# Altium project TSAL_Control.PrjPcb (part 3 of 4)

## Sheet [4] NoHV_RelaysClosed.SchDoc
size A4
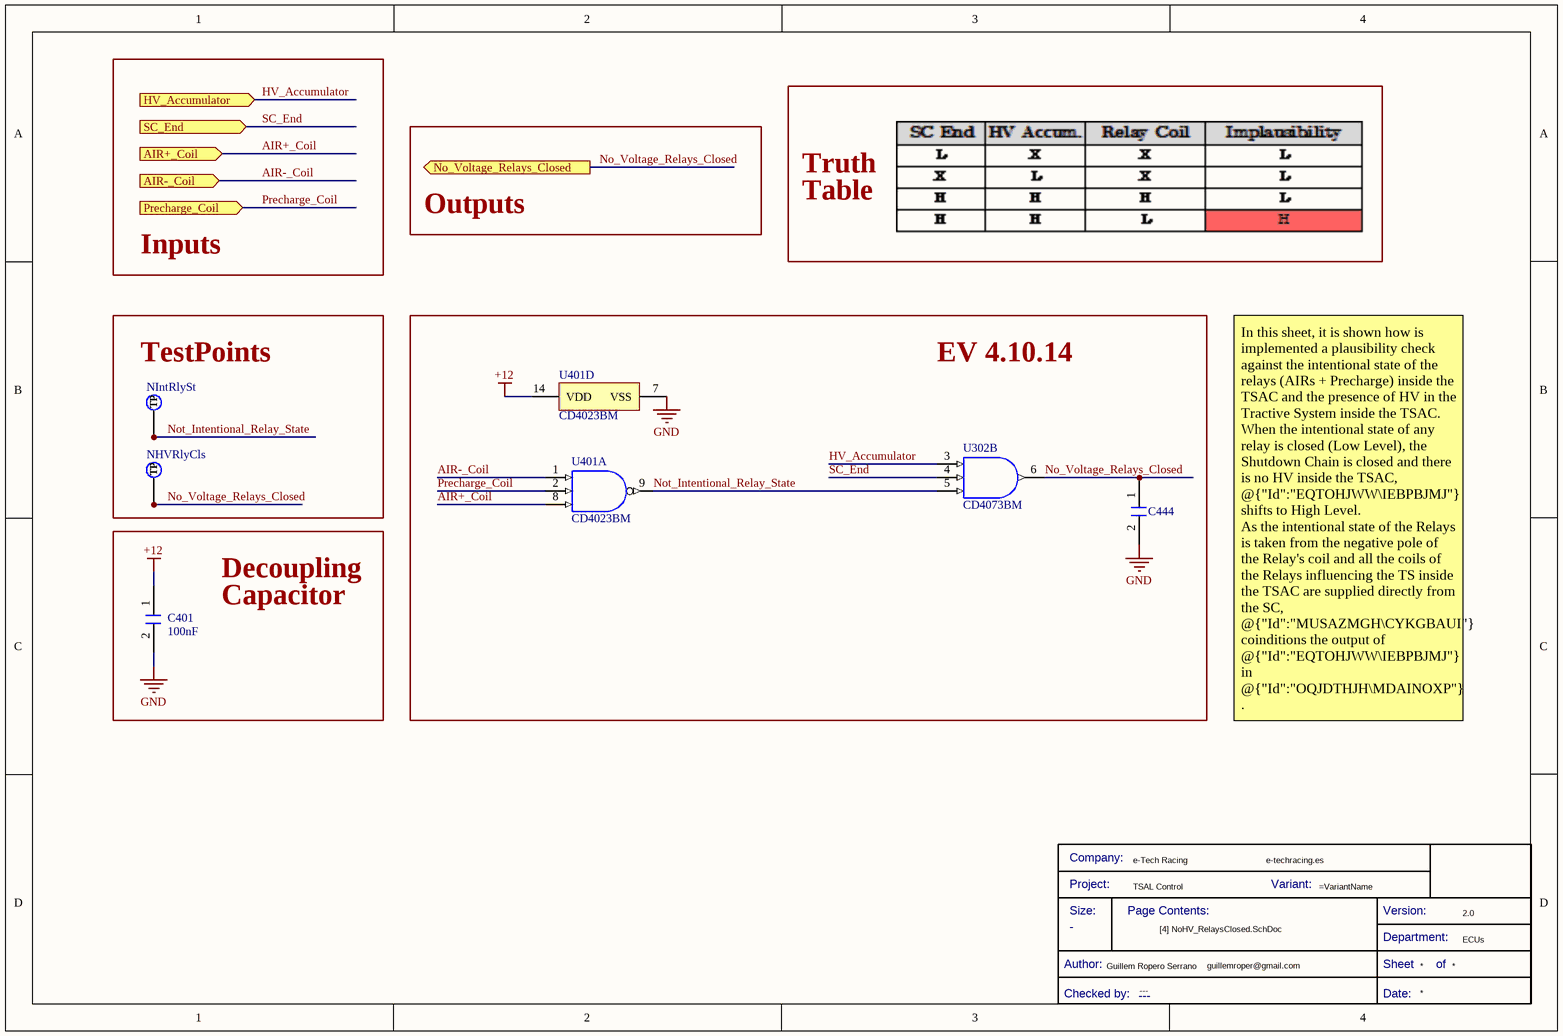
[diagram p5: [4] NoHV_RelaysClosed.SchDoc]

### Parts
(Parts that share a designator on the sheet are numbered #1, #2 ... from top to bottom, then left to right.)
*#6  Checked by:: ---  (hidden comment: Title Block_template)  (graphical)
C401  value 100nF  [C0805FNPC-R]  (hidden comment: C100n-50V-0805FNPC-X7R)
C444  C15p-50V-0805FNPC-NP0  [C0805FNPC-R]  (value not drawn)
NHVRlyCls  TestPoint  [TestPoint]  (value not drawn)  (no BOM)
NIntRlySt  TestPoint  [TestPoint]  (value not drawn)  (no BOM)
U302  CD4073BM  [D0014A_N]  (part B of 4)
U401  CD4023BM  [D0014A_N]  (parts A,D of 4)

### Blocks framed on the sheet
TestPoints: NHVRlyCls NIntRlySt
EV 4.10.14: C444 U302 U401

### Ports
AIR+_Coil (in, see [2] Implausibilities[3B], [1] TSAL_Green[2A], [2] Implausibilities[1A], [3] Relay Implausibility[1A]), AIR-_Coil (in, see [2] Implausibilities[3B], [1] TSAL_Green[2A], [2] Implausibilities[1A], [3] Relay Implausibility[1A]), HV_Accumulator (in, see [2] Implausibilities[3B], [1] TSAL_Green[2B], [2] Implausibilities[1A], [5] SCS[1A]), No_Voltage_Relays_Closed (out, see [2] Implausibilities[4B]), Precharge_Coil (in, see [2] Implausibilities[3B], [1] TSAL_Green[2B], [2] Implausibilities[1A], [3] Relay Implausibility[1A]), SC_End (in, see [2] Implausibilities[3B], [1] TSAL_Green[2B], [2] Implausibilities[1A], [3] Relay Implausibility[1B])

### Nets
+12: C401.1 U401.14(VDD)
GND: C401.2 C444.2 U401.7(VSS)
AIR+_Coil: U401.8(C) ; port AIR+_Coil
AIR-_Coil: U401.1(A) ; port AIR-_Coil
HV_Accumulator: U302.3(D) ; port HV_Accumulator
No_Voltage_Relays_Closed: C444.1 NHVRlyCls.1(TP) U302.6(K) ; port No_Voltage_Relays_Closed
Not_Intentional_Relay_State: NIntRlySt.1(TP) U302.5(F) U401.9(J)
Precharge_Coil: U401.2(B) ; port Precharge_Coil
SC_End: U302.4(E) ; port SC_End

### Notes on the sheet
- Truth
- Outputs
- Table
- Inputs
- Decoupling
- Capacitor
- In this sheet, it is shown how is implemented a plausibility check against the intentional state of the relays (AIRs + Precharge) inside the TSAC and the presence of HV in the Tractive System inside the TSAC.
  When the intentional state of any relay is closed (Low Level), the Shutdown Chain is closed and there is no HV inside the TSAC, @{"Id":"EQTOHJWW\IEBPBJMJ"} shifts to High Level.
  As the intentional state of the Relays is taken from the negative pole of the Relay's coil and all the coils of the Relays influencing the TS inside the TSAC are supplied directly from the SC, @{"Id":"MUSAZMGH\CYKGBAUI"} coinditions the output of @{"Id":"EQTOHJWW\IEBPBJMJ"} in @{"Id":"OQJDTHJH\MDAINOXP"} .
- (in symbol CMP-00043-8) Company:; Project:; Variant:; Size:; Page Contents:; Version:; Department:; Author:; Sheet; of; Checked by:; Date:

### Library data of the parts
*#6 = CMP-00043-8: Standard Title Block; .SCHcheck: GP; Size: -; Design Item ID: Title Block_template; .PCBcheck: GP; .Creator: GP; Source: e-Tech_Racing.SchLib; Category: Title Block
C401 = CMP-00063-3: Cap, 0.1ΜF, 50V, 10%, X7R, 0805; Manufacturer Part Number 1: 885012207098; Manufacturer 1: Wurth Electronics; .Creator: DR; ComponentLink2Description: http://www.farnell.com/datasheets/1958498.pdf?src-supplier=Element14; ComponentLink1Description: http://www.farnell.com/datasheets/1958498.pdf?src-supplier=Farnell; Thickness: 0.035inch; ComponentLink1URL: http://www.farnell.com/datasheets/1958498.pdf?src-supplier=Farnell; Min Operating Temperature: -55°C; Packaging: Cut Tape; ComponentLink2URL: http://www.farnell.com/datasheets/1958498.pdf?src-supplier=Element14; Mount: Surface Mount; Voltage Rating (DC): 50V; Tolerance: 10%; Category: Ceramic Capacitors; RoHS: Yes; Width: 0.049inch; Pricing 1: 100=0,10200, 500=0,07100, 2000=0,06100 (GBP); RoHS Compliant: Yes; ComponentLink4Description: http://www.farnell.com/datasheets/1958498.pdf?src-supplier=Newark; Dielectric: X7R; Stock 1: 8000; Length: 0.079inch; ComponentLink3URL: https://katalog.we-online.de/pbs/datasheet/885012207098.pdf?src-supplier=Digi-Key; ComponentLink3Description: https://katalog.we-online.de/pbs/datasheet/885012207098.pdf?src-supplier=Digi-Key; Design Item ID: C100n-50V-0805FNPC-X7R; ComponentLink4URL: http://www.farnell.com/datasheets/1958498.pdf?src-supplier=Newark; REACH SVHC: Unknown; Case Code (Metric): 2012; Voltage Rating: 50V; Max Operating Temperature: 125°C; Source: Passives.SchLib; Case/Package: 0805
C444 = CMP-00056-3: Cap, 15PF, 50V, 5%, C0G/NP0, 0805; Manufacturer Part Number 1: 885012007052; Manufacturer 1: Wurth Electronics; .Creator: DR; Thickness: 0.028inch; RoHS Compliant: Yes; ComponentLink2URL: http://katalog.we-online.de/pbs/datasheet/885012007052.pdf?src-supplier=Digi-Key; Design Item ID: C15p-50V-0805FNPC-NP0; Case Code (Metric): 2012; Max Operating Temperature: 125°C; Mount: Surface Mount; Category: Ceramic Capacitors; Min Operating Temperature: -55°C; Case/Package: 0805; ComponentLink3Description: https://katalog.we-online.de/pbs/datasheet/885012007052.pdf?src-supplier=Digi-Key; ComponentLink1Description: http://www.farnell.com/datasheets/2031702.pdf?src-supplier=Farnell; ComponentLink1URL: http://www.farnell.com/datasheets/2031702.pdf?src-supplier=Farnell; RoHS: Yes; Voltage Rating: 50V; Length: 0.079inch; Source: Passives.SchLib; Value: 15pF; Pricing 1: 1=0,10800, 10=0,05200, 25=0,05100, 50=0,04900, 100=0,04800, 250=0,04600, 500=0,04300 (USD); Tolerance: 5%; ComponentLink3URL: https://katalog.we-online.de/pbs/datasheet/885012007052.pdf?src-supplier=Digi-Key; Stock 1: 815; Packaging: Cut Tape; Width: 0.049inch; ComponentLink2Description: http://katalog.we-online.de/pbs/datasheet/885012007052.pdf?src-supplier=Digi-Key
NHVRlyCls NIntRlySt = CMP-00042-2: Test Point 1x1 mm; .SCHcheck: GP; Category: TestPoint; Source: e-Tech_Racing.SchLib; .Creator: GP; .PCBcheck: GP; Design Item ID: TestPoint
U302 = CMP-00213-1: AND Gate, 4000/14000/40000 Series, 3-Func, 3-Input, CMOS, PDSO14; Propagation Delay (tpd): 250ns; Nominal Supply Voltage: 5V; Power Supplies: 5/15V; Qualification Status: Not Qualified; Package Equivalence Code: SOP14,.25; Channels: 3; Min Supply Voltage: 3V; Package Body Material: Plastic; Max Supply Voltage: 18V; Load Capacitance (CL): 50pF; Load/Preset Input: Yes; Schmitt Trigger: No; Terminal Pitch: 1.27mm; Terminal Form: Gull Wing; Length: 8.65mm; Logic Type: AND GATE; Prop. Delay@Nom-Sup: 250ns; Package Style: SMALL OUTLINEMeter; JESD-609 Code: e4; Package Shape: Rectangular; Moisture Sensitivity Level: 1; Max Operating Temperature: 125°C; Min Operating Temperature: -55°C; Case/Package: SOP; Terminal Finish: Nickel; Width: 3.9mm; Surface Mount: Yes; Reach SVHC Compliant: Yes; Technology: CMOS; Terminal Position: DUAL; Height - Seated (Max): 1.75mm; Temperature Grade: MILITARY; Number of Inputs: 3; Packaging: Rail/Tube; Pins: 14; Peak Reflow Temperature (Cel): 260°C; JESD-30 Code: R-PDSO-G14; RoHS Compliant: Yes
U401 = CMP-00215-1: NAND Gate, 4000/14000/40000 Series, 3-Func, 3-Input, CMOS, CDIP14; Min Supply Voltage: 5V; Package Body Material: Metal; Surface Mount: No; Number of Inputs: 3; Max Supply Voltage: 15V; Qualification Status: Not Qualified; Nominal Supply Voltage: 10V; Propagation Delay (tpd): 250ns; Pins: 14; Case/Package: DIP; Terminal Pitch: 2.54mm; Terminal Form: Through Hole; Height - Seated (Max): 5.08mm; Max Operating Temperature: 125°C; Min Operating Temperature: -55°C; Package Shape: Rectangular; Width: 7.62mm; Logic Type: NAND GATE; Technology: CMOS; Channels: 3; Temperature Grade: MILITARY; Terminal Position: DUAL; Package Style: IN-LINEMeter

## Sheet [6] Green_Driver.SchDoc
size A4
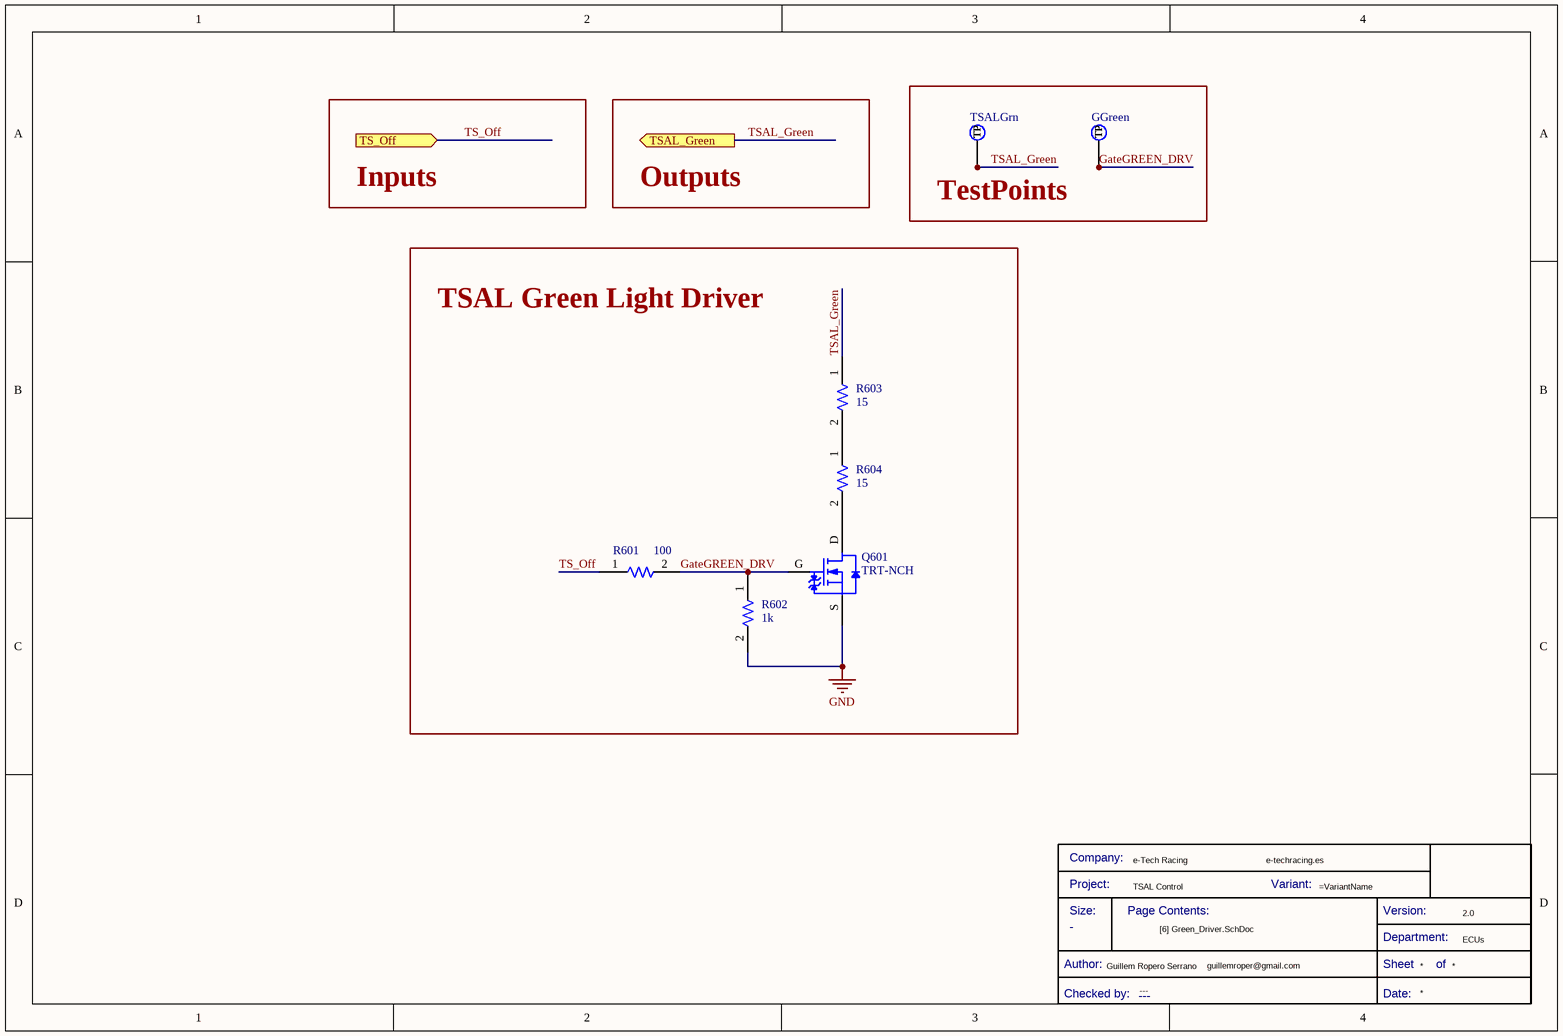
[diagram p6: [6] Green_Driver.SchDoc]

### Parts
(Parts that share a designator on the sheet are numbered #1, #2 ... from top to bottom, then left to right.)
*#7  Checked by:: ---  (hidden comment: Title Block_template)  (graphical)
GGreen  TestPoint  [TestPoint]  (value not drawn)  (no BOM)
Q601  TRT-NCH  [TRT-NCH-D2PAK]
R601  value 100  [R0805FTK]  (hidden comment: R100-0805FTK)
R602  value 1k  [R0805FTK]  (hidden comment: R1k-0805FTK)
R603  value 15  [R_3521]  (hidden comment: R15_3521_2W)
R604  value 15  [R_3521]  (hidden comment: R15_3521_2W)
TSALGrn  TestPoint  [TestPoint]  (value not drawn)  (no BOM)

### Blocks framed on the sheet
TestPoints: GGreen TSALGrn
TSAL Green Light Driver: Q601 R601-R604

### Ports
TS_Off (in, see [1] TSAL_Green[1D], [1] TSAL_Green[4A], [2] Implausibilities[1A], [5] SCS[1A]), TSAL_Green (out, see [1] TSAL_Green[2D], [1] TSAL_Green[4A], [2] Implausibilities[1A], [5] SCS[1A])

### Nets
GND: Q601.S R602.2
GateGREEN_DRV: GGreen.1(TP) Q601.G R601.2 R602.1
TS_Off: R601.1 ; port TS_Off
TSAL_Green: R603.1 TSALGrn.1(TP) ; port TSAL_Green
NetQ601_D: Q601.D R604.2
NetR603_2: R603.2 R604.1

### Notes on the sheet
- Inputs
- Outputs
- (in symbol CMP-00043-8) Company:; Project:; Variant:; Size:; Page Contents:; Version:; Department:; Author:; Sheet; of; Checked by:; Date:

### Library data of the parts
*#7 = CMP-00043-8: Standard Title Block; .SCHcheck: GP; Size: -; Design Item ID: Title Block_template; .PCBcheck: GP; .Creator: GP; Source: e-Tech_Racing.SchLib; Category: Title Block
GGreen TSALGrn = CMP-00042-2: Test Point 1x1 mm; .SCHcheck: GP; Category: TestPoint; Source: e-Tech_Racing.SchLib; .Creator: GP; .PCBcheck: GP; Design Item ID: TestPoint
Q601 = CMP-00139-1: MOSFET N-CH 100V 31A DPAK; Manufacturer 1: Infineon; Manufacturer Part Number 1: IRFR3410TRPBF; Rds On Max: 39mR; Turn-On Delay Time: 12ns; Polarization: N; Threshold Voltage: 4V; Power Dissipation: 110W; Input Capacitance: 1.69nF; Max Power Dissipation: 3W; Gate to Source Voltage (Vgs): 20V; Turn-Off Delay Time: 40ns; RoHS Compliant: Yes; Number of Pins: 3; Design Item ID: TRT-NCH-31/100; Packaging: Cut Tape; Min Operating Temperature: -55°C; Length: 0.264inch; Max Dual Supply Voltage: 100V; Halogen Free: Halogen Free; Drain to Source Resistance: 39mR; Case/Package: TO-252-3; Mount: Surface Mount; Series: HEXFET®; Source: Semiconductor.SchLib; Stock 1: 4070; Height: 0.094inch; Width: 0.245inch; RoHS: Yes; ComponentLink1URL: https://www.mouser.es/datasheet/2/427/sq2318bes-1868475.pdf; Pricing 1: 1=1,20000, 10=1,08000, 100=0,84200, 500=0,69600 (EUR); ComponentLink1Description: Datasheet; Lead Free: Contains Lead; Drain to Source Breakdown Voltage: 100V; Max Operating Temperature: 175°C; Drain to Source Voltage (Vdss): 100V; Category: MOSFETs; Continuous Drain Current (ID): 31A; Reach SVHC Compliant: Yes
R601 = CMP-00083-3: Res Thick Film 0805 100 Ohm 1% 1/8W ±100ppm/°C Molded SMD SMD Paper Tape on Plastic Reel; Manufacturer Part Number 1: CR0805-FX-1000ELF; Manufacturer 1: Bourns; Power Rating: 125mW; Voltage Rating (DC): 150V; .Creator: DR; Military Standard: Not; Radiation Hardening: No; Max Operating Temperature: 155°C; Packaging: Tape and Reel; ComponentLink3Description: https://datasheet.ciiva.com/6547/chpreztr-6547414.pdf?src-supplier=Digi-Key; RoHS Compliant: Yes; ComponentLink5Description: https://datasheet.ciiva.com/9120/chpreztr-9120744.pdf?src-supplier=Avnet; ComponentLink4URL: https://datasheet.ciiva.com/6547/chpreztr-6547415.pdf?src-supplier=Digi-Key; REACH SVHC: No SVHC; Depth: 1.25mm; Case/Package: 0805; Series: CR0805; Pricing 1: 1=0,05840, 10=0,03430, 25=0,01780, 100=0,00750, 250=0,00560, 500=0,00490, 3000=0,00470 (USD); Features: Moisture Resistant; Design Item ID: R100-0805FTK; Resistor Type: Thick Film; ComponentLink3URL: https://datasheet.ciiva.com/6547/chpreztr-6547414.pdf?src-supplier=Digi-Key; Construction: Rectangular; Width: 1.25mm; ComponentLink4Description: https://datasheet.ciiva.com/6547/chpreztr-6547415.pdf?src-supplier=Digi-Key; Stock 1: 49802; ComponentLink1URL: https://datasheet.ciiva.com/11809/0900766b80fcdb72-11809178.pdf?src-supplier=RSComponents; Number of Terminations: 2; ComponentLink1Description: https://datasheet.ciiva.com/11809/0900766b80fcdb72-11809178.pdf?src-supplier=RSComponents; Length: 2mm; Min Operating Temperature: -55°C; Height: 0.5mm; Mount: Surface Mount; Max Power Dissipation: 125mW; Technology: THICK FILM; Case Code (Metric): 2012; Tolerance: 1%; Category: Chip SMD Resistors; Thickness: 508um; Source: Passives.SchLib; Resistance Tolerance: 1%; RoHS: Yes; ComponentLink5URL: https://datasheet.ciiva.com/9120/chpreztr-9120744.pdf?src-supplier=Avnet; Temperature Coefficient: 100ppm/°C; Package Quantity: 1; Pins: 2; Contact Plating: Tin; Voltage Rating: 150V; Termination: SMD/SMT; ComponentLink2Description: https://datasheet.ciiva.com/6547/chpreztr-6547413.pdf?src-supplier=Digi-Key; ComponentLink2URL: https://datasheet.ciiva.com/6547/chpreztr-6547413.pdf?src-supplier=Digi-Key
R602 = CMP-00076-3: Res Thick Film 0805 1K Ohm 5% 1/8W ±200ppm/°C Molded SMD SMD Paper Tape on Plastic Reel; Manufacturer Part Number 1: CR0805-JW-102ELF; Manufacturer 1: Bourns; Voltage Rating (DC): 150V; Power Rating: 125mW; .Creator: GP; Number of Terminations: 2; REACH SVHC: No SVHC; ComponentLink3URL: https://datasheet.ciiva.com/22693/1902866-22693253.pdf?src-supplier=Element14; ComponentLink1URL: https://datasheet.ciiva.com/11821/0900766b80fcdb72-11821134.pdf?src-supplier=RSComponents; ComponentLink1Description: https://datasheet.ciiva.com/11821/0900766b80fcdb72-11821134.pdf?src-supplier=RSComponents; Category: Chip SMD Resistors; Stock 1: 27510; Case/Package: 0805; ComponentLink3Description: https://datasheet.ciiva.com/22693/1902866-22693253.pdf?src-supplier=Element14; Length: 2mm; ComponentLink5URL: https://datasheet.ciiva.com/7985/1856384-7985867.pdf?src-supplier=Element14; ComponentLink7Description: https://datasheet.ciiva.com/6547/chpreztr-6547359.pdf?src-supplier=Digi-Key; Package Quantity: 1; Tolerance: 5%; Lead Free: Lead Free; RoHS: Yes; Contact Plating: Tin; ComponentLink2Description: https://datasheet.ciiva.com/15225/getdatasheetpartid-78155-15225381.pdf?src-supplier=Verical; ComponentLink5Description: https://datasheet.ciiva.com/7985/1856384-7985867.pdf?src-supplier=Element14; Depth: 1.25mm; Thickness: 508um; Resistor Type: Thick Film; Design Item ID: R1k-0805FTK; ComponentLink2URL: https://datasheet.ciiva.com/15225/getdatasheetpartid-78155-15225381.pdf?src-supplier=Verical; Max Operating Temperature: 155°C; ComponentLink6URL: https://datasheet.ciiva.com/30242/159chpreztr-30242765.pdf?src-supplier=Onlinecomponents.com; ComponentLink4URL: https://datasheet.ciiva.com/7986/1856384-7986184.pdf?src-supplier=Element14; Military Standard: Not; Case Code (Metric): 2012; Temperature Coefficient: 200ppm/°C; Pricing 1: 1=0,05930, 10=0,03510, 25=0,01790, 100=0,00800, 250=0,00790, 500=0,00590, 1000=0,00360, 3000=0,00350, 6000=0,00250 (USD); Min Operating Temperature: -55°C; ComponentLink7URL: https://datasheet.ciiva.com/6547/chpreztr-6547359.pdf?src-supplier=Digi-Key; Width: 1.25mm; Source: Passives.SchLib; Max Power Dissipation: 125mW; Voltage Rating: 150V; ComponentLink4Description: https://datasheet.ciiva.com/7986/1856384-7986184.pdf?src-supplier=Element14; Features: Moisture Resistant; Mount: Surface Mount; Termination: SMD/SMT; Height: 0.5mm; Radiation Hardening: No; ComponentLink6Description: https://datasheet.ciiva.com/30242/159chpreztr-30242765.pdf?src-supplier=Onlinecomponents.com; Pins: 2; Packaging: Tape and Reel
R603 R604 = CMP-00075-7: Res Thick Film 2512 15 Ohm 1% 2W ±100ppm/C Pad SMD T/R; Manufacturer Part Number 1: 352115RFT; Manufacturer 1: TE Connectivity; .Creator: DR; Voltage Rating: 250V; Temperature Coefficient: 100ppm/°C; Number of Resistors: 1; Features: Automotive AEC-Q200; RoHS: Yes; ComponentLink2Description: Where buy it; Pricing 1: 10=0,64300, 250=0,62200, 1000=0,60000, 2000=0,55400, 2500=0,52100 (USD); ComponentLink1Description: Datasheet; Technology: THICK FILM; Stock 1: 1; Termination: Solder; ComponentLink2URL: https://es.rs-online.com/web/p/resistencias-de-montaje-en-superficie/7551110; Mount: Surface Mount; Resistance Tolerance: 1%; ComponentLink4Description: https://datasheet.ciiva.com/46391/1610601-46391493.pdf?src-supplier=Element14; Category: Chip SMD Resistors; Series: 3521, CGS; Depth: 3.2mm; ELV: Compliant; Tolerance: 1%; ComponentLink5Description: https://datasheet.ciiva.com/7657/1610601-7657542.pdf?src-supplier=Element14; Case Code (Metric): 6432; Design Item ID: R15-2512FTK; ComponentLink1URL: https://docs.rs-online.com/8bc1/0900766b81096b90.pdf; Max Operating Temperature: 155°C; ComponentLink4URL: https://datasheet.ciiva.com/46391/1610601-46391493.pdf?src-supplier=Element14; RoHS Compliant: Yes; Number of Terminations: 2; Source: Passives.SchLib; Resistor Type: Thick Film,Power resistor; Height: 0.55mm; Case/Package: 2512; ComponentLink3URL: https://datasheet.ciiva.com/25610/0900766b81096b90-25610033.pdf?src-supplier=RSComponents; Max Power Dissipation: 2W; Length: 6.3mm; Packaging: Tape and Reel; ComponentLink3Description: https://datasheet.ciiva.com/25610/0900766b81096b90-25610033.pdf?src-supplier=RSComponents; Voltage Rating (DC): 250V; Min Operating Temperature: -55°C; REACH SVHC: No SVHC; ComponentLink5URL: https://datasheet.ciiva.com/7657/1610601-7657542.pdf?src-supplier=Element14

## Sheet [7] TSAL_Red.SchDoc
size A4
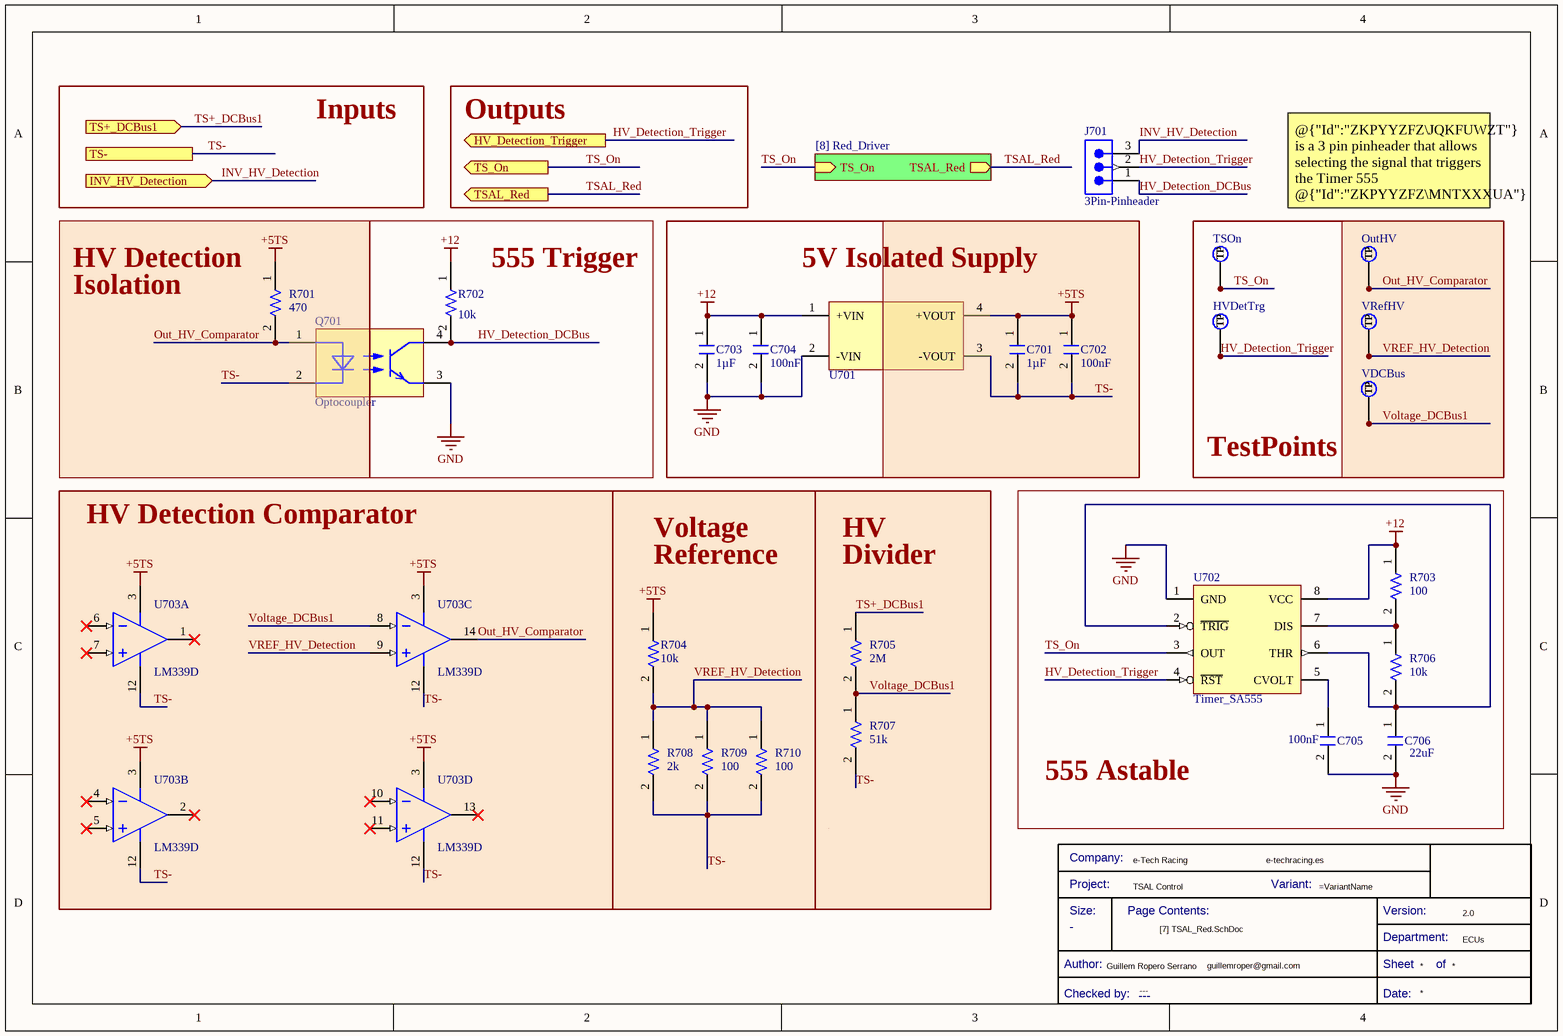
[diagram p7: [7] TSAL_Red.SchDoc]

### Parts
(Parts that share a designator on the sheet are numbered #1, #2 ... from top to bottom, then left to right.)
*#8  Checked by:: ---  (hidden comment: Title Block_template)  (graphical)
C701  value 1µF  [C0805FNPC-R]  (hidden comment: C1u-50V-0805FNPC-X7R)
C702  Capacitance: 100nF  [WCAP-CSGP_0805_L2W1.25H0.8_Reflow]  (hidden comment: C100n-16V-0805)
C703  value 1µF  [C0805FNPC-R]  (hidden comment: C1u-50V-0805FNPC-X7R)
C704  Capacitance: 100nF  [WCAP-CSGP_0805_L2W1.25H0.8_Reflow]  (hidden comment: C100n-16V-0805)
C705  value 100nF  [WCAP-CSGP_0805_L2W1.25H0.8_Reflow]  (hidden comment: C100n-16V-0805)
C706  value 22uF  [WCAP-CSGP_0805_L2W1.25H0.8_Reflow]  (hidden comment: C22u-25V-0805)
HVDetTrg  TestPoint  [TestPoint]  (value not drawn)  (no BOM)
J701  3Pin-Pinheader  [61300311121]
OutHV  TestPoint  [TestPoint]  (value not drawn)  (no BOM)
Q701  Optocoupler  [WL-OCPT_LSOP4]
R701  value 470  [R0805FTK]  (hidden comment: R470-0805FTK)
R702  value 10k  [R0805FTK]  (hidden comment: R10k-0805FTK)
R703  value 100  [R0805FTK]  (hidden comment: R100-0805FTK)
R704  Resistance: 10k  [0805]  (hidden comment: R10k_0805_0.25W)
R705  Resistance: 2M  [R2512FTK]  (hidden comment: R2M-2512FTK)
R706  value 10k  [R0805FTK]  (hidden comment: R10k-0805FTK)
R707  value 51k  [0805]  (hidden comment: R51k_0805)
R708  value 2k  [0805]  (hidden comment: R2K_0.5W_0805)
R709  value 100  [R0805FTK]  (hidden comment: R100-0805FTK)
R710  value 100  [R0805FTK]  (hidden comment: R100-0805FTK)
TSOn  TestPoint  [TestPoint]  (value not drawn)  (no BOM)
U701  DCDC_ISO_12VIN_5VOUT  [WPME-FISM_SIP-7_L19.65W7.05H10.16]  (value not drawn)
U702  Timer_SA555  [Timer_SA555]
U703  LM339D  [D0014A_N]  (parts A,B,C,D of 4)
VDCBus  TestPoint  [TestPoint]  (value not drawn)  (no BOM)
VRefHV  TestPoint  [TestPoint]  (value not drawn)  (no BOM)

### Blocks framed on the sheet
555 Trigger: Q701 R702
5V Isolated Supply: C701-C704 U701
TestPoints: HVDetTrg OutHV TSOn VDCBus VRefHV
HV Detection Comparator: U703
555 Astable: C705 C706 R703 R706 U702

### Sub-sheets
Red Driver = [8] Red_Driver: TS_On (in), TSAL_Red (out)

### Ports
HV_Detection_Trigger (out, see TSAL_Control[1D], [1] TSAL_Green[2B], [2] Implausibilities[1A], [5] SCS[1A]), INV_HV_Detection (in, see TSAL_Control[1D]), TS+_DCBus1 (in, see TSAL_Control[1C]), TS- (see TSAL_Control[1D]), TS_On (out, see TSAL_Control[1D], [8] Red_Driver[1A]), TSAL_Red (out, see TSAL_Control[1C], [1] TSAL_Green[3A], [2] Implausibilities[1A], [5] SCS[1B], [8] Red_Driver[2A])

### Nets
+5TS: C701.1 C702.1 R701.1 R704.1 U701.4(+VOUT) U703.3(VCC)
+12: C703.1 C704.1 R702.1 R703.1 U701.1(+VIN) U702.8(VCC)
GND: C703.2 C704.2 C705.2 C706.2 Q701.3(Emitter) U701.2(-VIN) U702.1(GND)
HV_Detection_DCBus: J701.1 Q701.4(Collector) R702.2
HV_Detection_Trigger: HVDetTrg.1(TP) J701.2 U702.4(~{RST}) ; port HV_Detection_Trigger
INV_HV_Detection: J701.3 ; port INV_HV_Detection
Out_HV_Comparator: OutHV.1(TP) Q701.1(Anode) R701.2 U703.14(OUT3)
TS+_DCBus1: R705.1 ; port TS+_DCBus1
TS-: C701.2 C702.2 Q701.2(Cathode) R707.2 R708.2 R709.2 R710.2 U701.3(-VOUT) U703.12(GND) ; port TS-
TS_On: TSOn.1(TP) U702.3(OUT) ; port TS_On, sheet Red Driver/TS_On
TSAL_Red: port TSAL_Red, sheet Red Driver/TSAL_Red
Voltage_DCBus1: R705.2 R707.1 U703.8(IN3-) VDCBus.1(TP)
VREF_HV_Detection: R704.2 R708.1 R709.1 R710.1 U703.9(IN3+) VRefHV.1(TP)
NetC705_1: C705.1 U702.5(CVOLT)
NetC706_1: C706.1 R706.2 U702.2(~{TRIG}) U702.6(THR)
NetR703_2: R703.2 R706.1 U702.7(DIS)

Not connected (* = marked no-connect by the designer): U703 1(OUT1)* 2(OUT2)* 4(IN2-)* 5(IN2+)* 6(IN1-)* 7(IN1+)* 10(IN4-)* 11(IN4+)* 13(OUT4)*

### Notes on the sheet
- Inputs
- Outputs
- @{"Id":"ZKPYYZFZ\JQKFUWZT"} is a 3 pin pinheader that allows selecting the signal that triggers the Timer 555 @{"Id":"ZKPYYZFZ\MNTXXXUA"} to oscillate and drive the TSAL Red.
- (near R701) HV Detection
- Isolation
- Voltage
- Reference
- HV
- Divider
- (in symbol CMP-00043-8) Company:; Project:; Variant:; Size:; Page Contents:; Version:; Department:; Author:; Sheet; of; Checked by:; Date:

### Library data of the parts
*#8 = CMP-00043-8: Standard Title Block; .SCHcheck: GP; Size: -; Design Item ID: Title Block_template; .PCBcheck: GP; .Creator: GP; Source: e-Tech_Racing.SchLib; Category: Title Block
C701 C703 = CMP-00052-2: Multilayer Ceramic Capacitor, Wcap-Csgp Series, 1 F, 10%, X7R, 50 V, 0805 [2012 Metric] Rohs Compliant: Yes; Manufacturer Part Number 1: 885012207103; Manufacturer 1: Wurth Electronics; Voltage Rating (DC): 50V; .Creator: GP; Max Operating Temperature: 85°C; Case/Package: 0805; ComponentLink1Description: http://www.farnell.com/datasheets/1958501.pdf?src-supplier=Farnell; Design Item ID: C1u-50V-0805FNPC-X7R; ComponentLink1URL: http://www.farnell.com/datasheets/1958501.pdf?src-supplier=Farnell; ComponentLink2Description: http://www.farnell.com/datasheets/1958501.pdf?src-supplier=Element14; ComponentLink3URL: https://katalog.we-online.de/pbs/datasheet/885012107003.pdf?src-supplier=Digi-Key; ComponentLink4Description: http://www.farnell.com/datasheets/1958501.pdf?src-supplier=Newark; Width: 0.049inch; RoHS Compliant: Yes; Case Code (Metric): 2012; Source: Passives.SchLib; Category: Ceramic Capacitors; Tolerance: 10%; Pricing 1: 50=0,27200, 250=0,25300, 500=0,22800, 1250=0,20100, 2500=0,17100 (GBP); RoHS: Yes; Mount: Surface Mount; Min Operating Temperature: -55°C; ComponentLink4URL: http://www.farnell.com/datasheets/1958501.pdf?src-supplier=Newark; Dielectric: X7R; ComponentLink3Description: https://katalog.we-online.de/pbs/datasheet/885012107003.pdf?src-supplier=Digi-Key; ComponentLink2URL: http://www.farnell.com/datasheets/1958501.pdf?src-supplier=Element14; REACH SVHC: Unknown; Length: 0.079inch; Packaging: Cut Tape; Thickness: 0.053inch; Stock 1: 5100; Voltage Rating: 50V
C702 C704 C705 = CMP-001-00008-6: Ceramic Capacitor, Multilayer, Ceramic, 16V, 10% +Tol, 10% -Tol, X7R, 15% TC, 0.1uF, Surface Mount, 0805; Pins: 2; RoHS Compliant: Yes; Capacitor Type: Ceramic
C706 = CMP-001-00017-4: 885012107019
HVDetTrg OutHV TSOn VDCBus VRefHV = CMP-00042-2: Test Point 1x1 mm; .SCHcheck: GP; Category: TestPoint; Source: e-Tech_Racing.SchLib; .Creator: GP; .PCBcheck: GP; Design Item ID: TestPoint
J701 = CMP-002-00009-1: Board Connector, 3 Contact(s), 1 Row(s), Male, Straight, 0.1 inch Pitch, Solder Terminal, Locking, Black Insulator, Plug; RoHS Compliant: Yes; Connector Type: BOARD CONNECTOR; Max Operating Temperature: 125°C; Min Operating Temperature: -40°C; Mounting Technology: Board
Q701 = CMP-00195-1: Transistor Output Optocoupler. S/N: 140100146000; RoHS Compliant: Yes
R701 = CMP-00093-3: Res Thick Film 0805 470 Ohm 1% 1/8W ±100ppm/°C Molded SMD SMD Paper Tape on Plastic Reel; Manufacturer Part Number 1: CR0805-FX-4700GLF; Manufacturer 1: Bourns; Voltage Rating (DC): 150V; Max Power Dissipation: 125mW; .Creator: DR; ComponentLink2URL: https://datasheet.ciiva.com/7985/1856384-7985880.pdf?src-supplier=Element14; Construction: Rectangular; Max Operating Temperature: 155°C; Thickness: 508um; Pins: 2; REACH SVHC: No SVHC; Features: Moisture Resistant; Voltage Rating: 150V; Source: Passives.SchLib; Pricing 1: 1=0,00990, 10=0,00980, 25=0,00950, 50=0,00940, 100=0,00930, 250=0,00920, 500=0,00910, 1000=0,00890, 3000=0,00870, 6000=0,00860 (USD); ComponentLink4URL: https://datasheet.ciiva.com/5541/chpreztr-5541930.pdf?src-supplier=Mouser; Design Item ID: R470-0805FTK; Depth: 1.25mm; Case Code (Metric): 2012; Technology: THICK FILM; RoHS: Yes; Power Rating: 125mW; Number of Terminations: 2; ComponentLink1URL: https://datasheet.ciiva.com/11808/0900766b80fcdb72-11808686.pdf?src-supplier=RSComponents; Tolerance: 1%; Radiation Hardening: No; Packaging: Tape and Reel; Resistor Type: Thick Film; Series: CR0805; Military Standard: Not; Termination: SMD/SMT; ComponentLink3URL: https://datasheet.ciiva.com/22693/1902866-22693247.pdf?src-supplier=Element14; Min Operating Temperature: -55°C; ComponentLink4Description: https://datasheet.ciiva.com/5541/chpreztr-5541930.pdf?src-supplier=Mouser; ComponentLink3Description: https://datasheet.ciiva.com/22693/1902866-22693247.pdf?src-supplier=Element14; Stock 1: 12623; Length: 2mm; Temperature Coefficient: 100ppm/°C; Contact Plating: Tin; ComponentLink1Description: https://datasheet.ciiva.com/11808/0900766b80fcdb72-11808686.pdf?src-supplier=RSComponents; Case/Package: 0805; Category: Chip SMD Resistors; ComponentLink2Description: https://datasheet.ciiva.com/7985/1856384-7985880.pdf?src-supplier=Element14; Height: 0.5mm; Mount: Surface Mount; Resistance Tolerance: 1%
R702 R706 = CMP-00085-4: BOURNS         CR0805-JW-103ELF            Surface Mount Chip Resistor, Thick Film, CR Series, 10 kohm, 125 mW,  5%, 150 V; .Creator: DR; Power Rating: 125mW; Voltage Rating (DC): 100V; Voltage Rating: 150V; Temperature Coefficient: 200ppm/°C; ComponentLink6URL: https://datasheet.ciiva.com/16783/70154685-16783482.pdf?src-supplier=Allied+Electronics; Manufacturer 1: Bourns; Package Quantity: 1; ComponentLink10URL: https://datasheet.ciiva.com/7985/1856384-7985869.pdf?src-supplier=Element14; Technology: THICK FILM; Source: Passives.SchLib; RoHS Compliant: Yes; ComponentLink10Description: https://datasheet.ciiva.com/7985/1856384-7985869.pdf?src-supplier=Element14; ComponentLink1URL: https://datasheet.ciiva.com/11821/0900766b80fcdb72-11821135.pdf?src-supplier=RSComponents; ComponentLink7Description: https://datasheet.ciiva.com/5548/chpreztr-5548491.pdf?src-supplier=Mouser; Radiation Hardening: No; Design Item ID: R10k-0805FTK; ComponentLink4Description: https://datasheet.ciiva.com/7986/691949-7986187.pdf?src-supplier=Element14; Pins: 2; ComponentLink9URL: https://datasheet.ciiva.com/6559/chpreztr-6559901.pdf?src-supplier=Digi-Key; Resistor Type: Thick Film; ComponentLink4URL: https://datasheet.ciiva.com/7986/691949-7986187.pdf?src-supplier=Element14; Contact Plating: Tin; Case Code (Metric): 2012; Military Standard: Not; Depth: 1.25mm; Case/Package: 0805; Packaging: Tape and Reel; ComponentLink9Description: https://datasheet.ciiva.com/6559/chpreztr-6559901.pdf?src-supplier=Digi-Key; Construction: Rectangular; Pricing 1: 1=0,05790, 10=0,01540, 25=0,01340, 100=0,00340 (USD); ComponentLink7URL: https://datasheet.ciiva.com/5548/chpreztr-5548491.pdf?src-supplier=Mouser; Category: Chip SMD Resistors; Length: 2mm; Max Operating Temperature: 155°C; Resistance Tolerance: 5%; Manufacturer Part Number 1: CR0805-JW-103ELF; Height: 0.5mm; ComponentLink2URL: https://datasheet.ciiva.com/9122/chpreztr-9122374.pdf?src-supplier=Avnet; Thickness: 508um; Max Power Dissipation: 125mW; ComponentLink8Description: https://datasheet.ciiva.com/6559/chpreztr-6559900.pdf?src-supplier=Digi-Key; REACH SVHC: No SVHC; ComponentLink8URL: https://datasheet.ciiva.com/6559/chpreztr-6559900.pdf?src-supplier=Digi-Key; ComponentLink5URL: https://datasheet.ciiva.com/30065/159chpreztr-30065976.pdf?src-supplier=Onlinecomponents.com; Width: 1.25mm; ComponentLink11URL: https://datasheet.ciiva.com/48692/001055517-da-01-en-smd-wid-cr0805-jw-103elf-10k-ohm-1-8w-48692118.pdf?src-supplier=Conrad; ComponentLink3Description: https://datasheet.ciiva.com/22693/1902866-22693254.pdf?src-supplier=Element14; ComponentLink11Description: https://datasheet.ciiva.com/48692/001055517-da-01-en-smd-wid-cr0805-jw-103elf-10k-ohm-1-8w-48692118.pdf?src-supplier=Conrad; ComponentLink1Description: https://datasheet.ciiva.com/11821/0900766b80fcdb72-11821135.pdf?src-supplier=RSComponents; ComponentLink2Description: https://datasheet.ciiva.com/9122/chpreztr-9122374.pdf?src-supplier=Avnet; Stock 1: 57566; Min Operating Temperature: -55°C; Series: CR0805; Number of Terminations: 2; Termination: SMD/SMT; Tolerance: 5%; Mount: Surface Mount; ComponentLink6Description: https://datasheet.ciiva.com/16783/70154685-16783482.pdf?src-supplier=Allied+Electronics; ComponentLink5Description: https://datasheet.ciiva.com/30065/159chpreztr-30065976.pdf?src-supplier=Onlinecomponents.com; RoHS: Yes; Features: Moisture Resistant; ComponentLink3URL: https://datasheet.ciiva.com/22693/1902866-22693254.pdf?src-supplier=Element14
R703 = CMP-00083-3: as R601 on sheet [6] Green_Driver; Military Standard: Not; Radiation Hardening: No; Max Operating Temperature: 155°C; Packaging: Tape and Reel; ComponentLink3Description: https://datasheet.ciiva.com/6547/chpreztr-6547414.pdf?src-supplier=Digi-Key; RoHS Compliant: Yes; ComponentLink5Description: https://datasheet.ciiva.com/9120/chpreztr-9120744.pdf?src-supplier=Avnet; ComponentLink4URL: https://datasheet.ciiva.com/6547/chpreztr-6547415.pdf?src-supplier=Digi-Key; REACH SVHC: No SVHC; Depth: 1.25mm; Case/Package: 0805; Series: CR0805; Pricing 1: 1=0,05840, 10=0,03430, 25=0,01780, 100=0,00750, 250=0,00560, 500=0,00490, 3000=0,00470 (USD); Features: Moisture Resistant; Design Item ID: R100-0805FTK; Resistor Type: Thick Film; ComponentLink3URL: https://datasheet.ciiva.com/6547/chpreztr-6547414.pdf?src-supplier=Digi-Key; Construction: Rectangular; Width: 1.25mm; ComponentLink4Description: https://datasheet.ciiva.com/6547/chpreztr-6547415.pdf?src-supplier=Digi-Key; Stock 1: 49802; ComponentLink1URL: https://datasheet.ciiva.com/11809/0900766b80fcdb72-11809178.pdf?src-supplier=RSComponents; Number of Terminations: 2; ComponentLink1Description: https://datasheet.ciiva.com/11809/0900766b80fcdb72-11809178.pdf?src-supplier=RSComponents; Length: 2mm; Min Operating Temperature: -55°C; Height: 0.5mm; Mount: Surface Mount; Max Power Dissipation: 125mW; Technology: THICK FILM; Case Code (Metric): 2012; Tolerance: 1%; Category: Chip SMD Resistors; Thickness: 508um; Source: Passives.SchLib; Resistance Tolerance: 1%; RoHS: Yes; ComponentLink5URL: https://datasheet.ciiva.com/9120/chpreztr-9120744.pdf?src-supplier=Avnet; Temperature Coefficient: 100ppm/°C; Package Quantity: 1; Pins: 2; Contact Plating: Tin; Voltage Rating: 150V; Termination: SMD/SMT; ComponentLink2Description: https://datasheet.ciiva.com/6547/chpreztr-6547413.pdf?src-supplier=Digi-Key; ComponentLink2URL: https://datasheet.ciiva.com/6547/chpreztr-6547413.pdf?src-supplier=Digi-Key
R704 = CMP-009-00035-5: Resistor, 10K, 0.25W, Thick Film, 0805 Rohs Compliant: Yes
R705 = CMP-00108-3: Current Sense Resistors - SMD 3watts .002ohms 1%; Manufacturer: Vishay Dale; Manufacturer Part Number: WSLP25122L000FEA; Power Rating: 3W; Temperature Coefficient: 275ppm/°C; Packaging: Tape and Reel; Height: 0.635mm; Weight: 0.001429oz; Case Code (Imperial): 2512; Source: Passives.SchLib; Tolerance: 1%; Termination: SMD/SMT; RoHS: Yes; Size Code: 2512; Case Code (Metric): 6432; Stock 1: 11994; ComponentLink1URL: https://datasheet.ciiva.com/48527/wslp-48527354.pdf?src-supplier=Avnet; Package Quantity: 2000; Length: 6.4mm; Resistor Type: Metal Strip; ComponentLink1Description: https://datasheet.ciiva.com/48527/wslp-48527354.pdf?src-supplier=Avnet; Design Item ID: R2M-2512FTK; Mount: Surface Mount; Width: 3.2mm; Category: Chip SMD Resistors; RoHS Compliant: Yes; Case/Package: 2512; Max Operating Temperature: 170°C; Lead Free: Lead Free; Pricing 1: 1=1,07000, 10=1,07000, 50=1,07000, 100=1,07000, 1000=0,77100, 10000=0,75500 (USD); Series: WSLP; Min Operating Temperature: -65°C
R707 = CMP-009-00018-5: Fixed Resistor, Metal Glaze/thick Film, 0.125W, 51000ohm, 150V, 1% +/-Tol, 100ppm/Cel, Surface Mount, 0805. ERJ-6ENF5102V; Power: 125mW; Mounting Technology: Surface Mount; Pins: 2; Case/Package: 0805; RoHS Compliant: Yes; Tolerance: 1%; Min Operating Temperature: -55°C; Max Operating Temperature: 155°C
R708 = CMP-009-00027-3: Fixed Resistor, Metal Glaze/thick Film, 0.5W, 2000ohm, 150V, 1% +/-Tol, 100ppm/Cel, Surface Mount, 0805; Manufacturer: Vishay; Part Number: CRCW08052K00FKEAHP; Power: 500mW; Min Operating Temperature: -55°C; Max Operating Temperature: 155°C; RoHS Compliant: Yes; Tolerance: 1%; Mounting Technology: Surface Mount; Pins: 2; Case/Package: 0805
R709 R710 = CMP-00083-3: Res Thick Film 0805 100 Ohm 1% 1/8W ±100ppm/°C Molded SMD SMD Paper Tape on Plastic Reel; Manufacturer 1: Bourns; Manufacturer Part Number 1: CR0805-FX-1000ELF; .Creator: DR; Voltage Rating: 150V; Power Rating: 125mW; Stock 1: 49802; Category: Chip SMD Resistors; Number of Terminations: 2; RoHS Compliant: Yes; Package Quantity: 1; Case/Package: 0805; Features: Moisture Resistant; Source: Passives.SchLib; Military Standard: Not; Construction: Rectangular; RoHS: Yes; Packaging: Tape and Reel; ComponentLink3URL: https://datasheet.ciiva.com/6547/chpreztr-6547414.pdf?src-supplier=Digi-Key; Resistance Tolerance: 1%; Termination: SMD/SMT; Height: 0.5mm; Radiation Hardening: No; Pricing 1: 1=0,05840, 10=0,03430, 25=0,01780, 100=0,00750, 250=0,00560, 500=0,00490, 3000=0,00470 (USD); ComponentLink2URL: https://datasheet.ciiva.com/6547/chpreztr-6547413.pdf?src-supplier=Digi-Key; ComponentLink5Description: https://datasheet.ciiva.com/9120/chpreztr-9120744.pdf?src-supplier=Avnet; Pins: 2; ComponentLink4URL: https://datasheet.ciiva.com/6547/chpreztr-6547415.pdf?src-supplier=Digi-Key; Temperature Coefficient: 100ppm/°C; Resistor Type: Thick Film; ComponentLink3Description: https://datasheet.ciiva.com/6547/chpreztr-6547414.pdf?src-supplier=Digi-Key; Width: 1.25mm; ComponentLink4Description: https://datasheet.ciiva.com/6547/chpreztr-6547415.pdf?src-supplier=Digi-Key; Length: 2mm; ComponentLink5URL: https://datasheet.ciiva.com/9120/chpreztr-9120744.pdf?src-supplier=Avnet; Case Code (Metric): 2012; Design Item ID: R100-0805FTK; ComponentLink1Description: https://datasheet.ciiva.com/11809/0900766b80fcdb72-11809178.pdf?src-supplier=RSComponents; ComponentLink1URL: https://datasheet.ciiva.com/11809/0900766b80fcdb72-11809178.pdf?src-supplier=RSComponents; Thickness: 508um; ComponentLink2Description: https://datasheet.ciiva.com/6547/chpreztr-6547413.pdf?src-supplier=Digi-Key; Series: CR0805; Min Operating Temperature: -55°C; REACH SVHC: No SVHC; Technology: THICK FILM; Contact Plating: Tin; Tolerance: 1%; Max Operating Temperature: 155°C; Max Power Dissipation: 125mW; Voltage Rating (DC): 150V; Depth: 1.25mm; Mount: Surface Mount
U701 = CMP-019-00001-3: WPME-FISM Fixed Isolated SIP/SMT Module
U702 = CMP-00181-3: Precision timer for -55 to 85C operation 8-SOIC -40 to 85; Manufacturer Part Number: SA555D; Manufacturer: Texas Instruments; Max Supply Voltage: 16V; Quiescent Current: 15mA; Min Supply Voltage: 4.5V; Low Level Output Current: 200mA; Frequency: 500kHz; Nominal Supply Current: 2mA; Number of Timers/Counters: 1; .Creator: DO; Operating Supply Current: 10mA; High Level Output Current: -200mA; ComponentLink4Description: https://datasheet.ciiva.com/1139/1851962-1139987.pdf?src-supplier=Element14; Mount: Surface Mount; ComponentLink4URL: https://datasheet.ciiva.com/1139/1851962-1139987.pdf?src-supplier=Element14; Packaging: Rail/Tube; Radiation Hardening: No; ComponentLink5URL: https://datasheet.ciiva.com/15152/getdatasheetpartid-75292-15152565.pdf?src-supplier=Verical; ComponentLink2Description: https://datasheet.ciiva.com/14094/ne555-series-eng-tds-14094951.pdf?src-supplier=Distrelec; ComponentLink3Description: https://datasheet.ciiva.com/1233/sa555-1233455.pdf?src-supplier=Digi-Key; Contact Plating: Gold; ComponentLink1Description: https://datasheet.ciiva.com/1147/na555-1147816.pdf?src-supplier=Newark; Weight: 0.002561oz; Height: 1.58mm; Min Operating Temperature: -40°C; Package Quantity: 75; ComponentLink6Description: Where buy it; Design Item ID: Timer_SA555; Case/Package: SOIC; Lead Free: Lead Free; ComponentLink6URL: https://www.mouser.es/ProductDetail/Texas-Instruments/SA555D?qs=gb35HGp1gQJkvy2FEVqR%2Fw%3D%3D; Category: Timers and Oscillators; ComponentLink1URL: https://datasheet.ciiva.com/1147/na555-1147816.pdf?src-supplier=Newark; ComponentLink2URL: https://datasheet.ciiva.com/14094/ne555-series-eng-tds-14094951.pdf?src-supplier=Distrelec; REACH SVHC: No SVHC; Max Operating Temperature: 85°C; Number of Pins: 8; Length: 4.9mm; ComponentLink5Description: https://datasheet.ciiva.com/15152/getdatasheetpartid-75292-15152565.pdf?src-supplier=Verical; RoHS Compliant: Yes; Stock 1: 1162; Pricing 1: 1=0,93000, 10=0,83500, 25=0,79240, 100=0,65090, 250=0,60848, 500=0,53774, 1000=0,46725 (USD); ComponentLink3URL: https://datasheet.ciiva.com/1233/sa555-1233455.pdf?src-supplier=Digi-Key; RoHS: Yes; Width: 3.91mm; Source: Integrated circuits.SchLib
U703 = CMP-014-00006-1: Comparator, 4 Func, 5000uV Offset-Max, 300ns Response Time, BIPolar, PDSO14; Nominal Supply Voltage: 5V; Channels: 4; Output Type: OPEN-COLLECTOR; Case/Package: SOP; Pins: 14; Max Operating Temperature: 70°C; Min Operating Temperature: 0°C; RoHS Compliant: Yes

## Sheet [8] Red_Driver.SchDoc
size A4
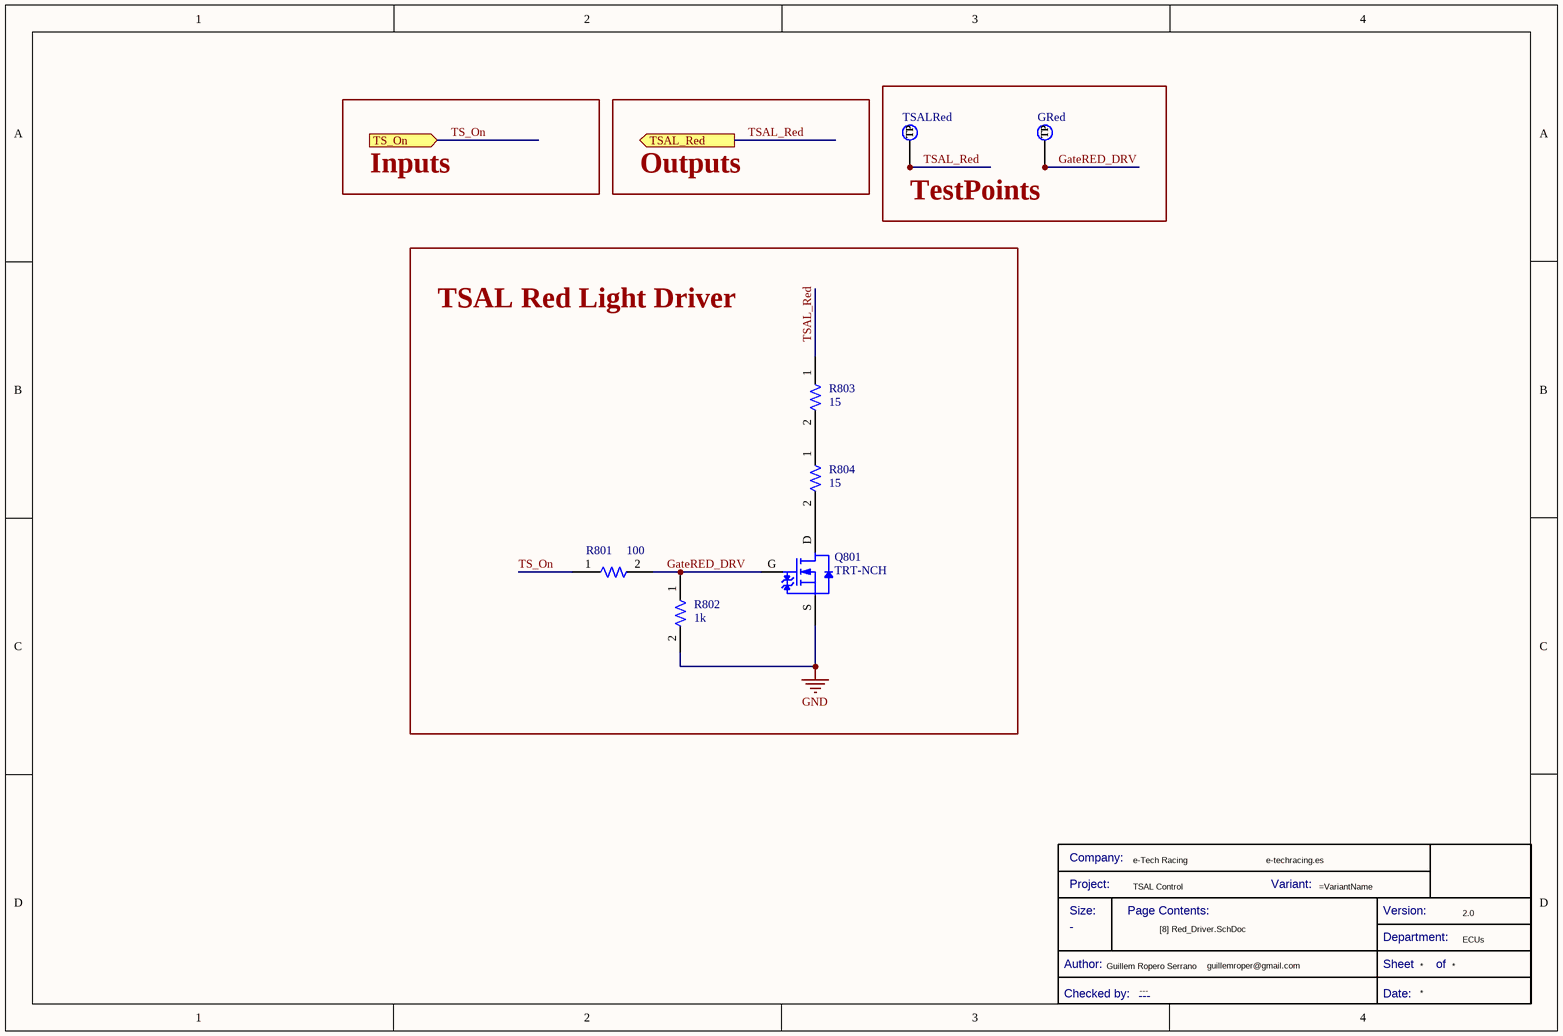
[diagram p8: [8] Red_Driver.SchDoc]

### Parts
(Parts that share a designator on the sheet are numbered #1, #2 ... from top to bottom, then left to right.)
*#9  Checked by:: ---  (hidden comment: Title Block_template)  (graphical)
GRed  TestPoint  [TestPoint]  (value not drawn)  (no BOM)
Q801  TRT-NCH  [TRT-NCH-D2PAK]
R801  value 100  [R0805FTK]  (hidden comment: R100-0805FTK)
R802  value 1k  [R0805FTK]  (hidden comment: R1k-0805FTK)
R803  value 15  [R_3521]  (hidden comment: R15_3521_2W)
R804  value 15  [R_3521]  (hidden comment: R15_3521_2W)
TSALRed  TestPoint  [TestPoint]  (value not drawn)  (no BOM)

### Blocks framed on the sheet
TestPoints: GRed TSALRed
TSAL Red Light Driver: Q801 R801-R804

### Ports
TS_On (in, see [7] TSAL_Red[3A], [7] TSAL_Red[2A]), TSAL_Red (out, see [7] TSAL_Red[3A], [1] TSAL_Green[3A], [2] Implausibilities[1A], [5] SCS[1B], [7] TSAL_Red[2A])

### Nets
GND: Q801.S R802.2
GateRED_DRV: GRed.1(TP) Q801.G R801.2 R802.1
TS_On: R801.1 ; port TS_On
TSAL_Red: R803.1 TSALRed.1(TP) ; port TSAL_Red
NetQ801_D: Q801.D R804.2
NetR803_2: R803.2 R804.1

### Notes on the sheet
- Inputs
- Outputs
- (in symbol CMP-00043-8) Company:; Project:; Variant:; Size:; Page Contents:; Version:; Department:; Author:; Sheet; of; Checked by:; Date:

### Library data of the parts
*#9 = CMP-00043-8: Standard Title Block; .SCHcheck: GP; Size: -; Design Item ID: Title Block_template; .PCBcheck: GP; .Creator: GP; Source: e-Tech_Racing.SchLib; Category: Title Block
GRed TSALRed = CMP-00042-2: Test Point 1x1 mm; .SCHcheck: GP; Category: TestPoint; Source: e-Tech_Racing.SchLib; .Creator: GP; .PCBcheck: GP; Design Item ID: TestPoint
Q801 = CMP-00139-1: as Q601 on sheet [6] Green_Driver; RoHS Compliant: Yes; Number of Pins: 3; Design Item ID: TRT-NCH-31/100; Packaging: Cut Tape; Min Operating Temperature: -55°C; Length: 0.264inch; Max Dual Supply Voltage: 100V; Halogen Free: Halogen Free; Drain to Source Resistance: 39mR; Case/Package: TO-252-3; Mount: Surface Mount; Series: HEXFET®; Source: Semiconductor.SchLib; Stock 1: 4070; Height: 0.094inch; Width: 0.245inch; RoHS: Yes; ComponentLink1URL: https://www.mouser.es/datasheet/2/427/sq2318bes-1868475.pdf; Pricing 1: 1=1,20000, 10=1,08000, 100=0,84200, 500=0,69600 (EUR); ComponentLink1Description: Datasheet; Lead Free: Contains Lead; Drain to Source Breakdown Voltage: 100V; Max Operating Temperature: 175°C; Drain to Source Voltage (Vdss): 100V; Category: MOSFETs; Continuous Drain Current (ID): 31A; Reach SVHC Compliant: Yes
R801 = CMP-00083-3: as R601 on sheet [6] Green_Driver; Military Standard: Not; Radiation Hardening: No; Max Operating Temperature: 155°C; Packaging: Tape and Reel; ComponentLink3Description: https://datasheet.ciiva.com/6547/chpreztr-6547414.pdf?src-supplier=Digi-Key; RoHS Compliant: Yes; ComponentLink5Description: https://datasheet.ciiva.com/9120/chpreztr-9120744.pdf?src-supplier=Avnet; ComponentLink4URL: https://datasheet.ciiva.com/6547/chpreztr-6547415.pdf?src-supplier=Digi-Key; REACH SVHC: No SVHC; Depth: 1.25mm; Case/Package: 0805; Series: CR0805; Pricing 1: 1=0,05840, 10=0,03430, 25=0,01780, 100=0,00750, 250=0,00560, 500=0,00490, 3000=0,00470 (USD); Features: Moisture Resistant; Design Item ID: R100-0805FTK; Resistor Type: Thick Film; ComponentLink3URL: https://datasheet.ciiva.com/6547/chpreztr-6547414.pdf?src-supplier=Digi-Key; Construction: Rectangular; Width: 1.25mm; ComponentLink4Description: https://datasheet.ciiva.com/6547/chpreztr-6547415.pdf?src-supplier=Digi-Key; Stock 1: 49802; ComponentLink1URL: https://datasheet.ciiva.com/11809/0900766b80fcdb72-11809178.pdf?src-supplier=RSComponents; Number of Terminations: 2; ComponentLink1Description: https://datasheet.ciiva.com/11809/0900766b80fcdb72-11809178.pdf?src-supplier=RSComponents; Length: 2mm; Min Operating Temperature: -55°C; Height: 0.5mm; Mount: Surface Mount; Max Power Dissipation: 125mW; Technology: THICK FILM; Case Code (Metric): 2012; Tolerance: 1%; Category: Chip SMD Resistors; Thickness: 508um; Source: Passives.SchLib; Resistance Tolerance: 1%; RoHS: Yes; ComponentLink5URL: https://datasheet.ciiva.com/9120/chpreztr-9120744.pdf?src-supplier=Avnet; Temperature Coefficient: 100ppm/°C; Package Quantity: 1; Pins: 2; Contact Plating: Tin; Voltage Rating: 150V; Termination: SMD/SMT; ComponentLink2Description: https://datasheet.ciiva.com/6547/chpreztr-6547413.pdf?src-supplier=Digi-Key; ComponentLink2URL: https://datasheet.ciiva.com/6547/chpreztr-6547413.pdf?src-supplier=Digi-Key
R802 = CMP-00076-3: as R602 on sheet [6] Green_Driver; Number of Terminations: 2; REACH SVHC: No SVHC; ComponentLink3URL: https://datasheet.ciiva.com/22693/1902866-22693253.pdf?src-supplier=Element14; ComponentLink1URL: https://datasheet.ciiva.com/11821/0900766b80fcdb72-11821134.pdf?src-supplier=RSComponents; ComponentLink1Description: https://datasheet.ciiva.com/11821/0900766b80fcdb72-11821134.pdf?src-supplier=RSComponents; Category: Chip SMD Resistors; Stock 1: 27510; Case/Package: 0805; ComponentLink3Description: https://datasheet.ciiva.com/22693/1902866-22693253.pdf?src-supplier=Element14; Length: 2mm; ComponentLink5URL: https://datasheet.ciiva.com/7985/1856384-7985867.pdf?src-supplier=Element14; ComponentLink7Description: https://datasheet.ciiva.com/6547/chpreztr-6547359.pdf?src-supplier=Digi-Key; Package Quantity: 1; Tolerance: 5%; Lead Free: Lead Free; RoHS: Yes; Contact Plating: Tin; ComponentLink2Description: https://datasheet.ciiva.com/15225/getdatasheetpartid-78155-15225381.pdf?src-supplier=Verical; ComponentLink5Description: https://datasheet.ciiva.com/7985/1856384-7985867.pdf?src-supplier=Element14; Depth: 1.25mm; Thickness: 508um; Resistor Type: Thick Film; Design Item ID: R1k-0805FTK; ComponentLink2URL: https://datasheet.ciiva.com/15225/getdatasheetpartid-78155-15225381.pdf?src-supplier=Verical; Max Operating Temperature: 155°C; ComponentLink6URL: https://datasheet.ciiva.com/30242/159chpreztr-30242765.pdf?src-supplier=Onlinecomponents.com; ComponentLink4URL: https://datasheet.ciiva.com/7986/1856384-7986184.pdf?src-supplier=Element14; Military Standard: Not; Case Code (Metric): 2012; Temperature Coefficient: 200ppm/°C; Pricing 1: 1=0,05930, 10=0,03510, 25=0,01790, 100=0,00800, 250=0,00790, 500=0,00590, 1000=0,00360, 3000=0,00350, 6000=0,00250 (USD); Min Operating Temperature: -55°C; ComponentLink7URL: https://datasheet.ciiva.com/6547/chpreztr-6547359.pdf?src-supplier=Digi-Key; Width: 1.25mm; Source: Passives.SchLib; Max Power Dissipation: 125mW; Voltage Rating: 150V; ComponentLink4Description: https://datasheet.ciiva.com/7986/1856384-7986184.pdf?src-supplier=Element14; Features: Moisture Resistant; Mount: Surface Mount; Termination: SMD/SMT; Height: 0.5mm; Radiation Hardening: No; ComponentLink6Description: https://datasheet.ciiva.com/30242/159chpreztr-30242765.pdf?src-supplier=Onlinecomponents.com; Pins: 2; Packaging: Tape and Reel
R803 R804 = CMP-00075-7: as R603 on sheet [6] Green_Driver; Features: Automotive AEC-Q200; RoHS: Yes; ComponentLink2Description: Where buy it; Pricing 1: 10=0,64300, 250=0,62200, 1000=0,60000, 2000=0,55400, 2500=0,52100 (USD); ComponentLink1Description: Datasheet; Technology: THICK FILM; Stock 1: 1; Termination: Solder; ComponentLink2URL: https://es.rs-online.com/web/p/resistencias-de-montaje-en-superficie/7551110; Mount: Surface Mount; Resistance Tolerance: 1%; ComponentLink4Description: https://datasheet.ciiva.com/46391/1610601-46391493.pdf?src-supplier=Element14; Category: Chip SMD Resistors; Series: 3521, CGS; Depth: 3.2mm; ELV: Compliant; Tolerance: 1%; ComponentLink5Description: https://datasheet.ciiva.com/7657/1610601-7657542.pdf?src-supplier=Element14; Case Code (Metric): 6432; Design Item ID: R15-2512FTK; ComponentLink1URL: https://docs.rs-online.com/8bc1/0900766b81096b90.pdf; Max Operating Temperature: 155°C; ComponentLink4URL: https://datasheet.ciiva.com/46391/1610601-46391493.pdf?src-supplier=Element14; RoHS Compliant: Yes; Number of Terminations: 2; Source: Passives.SchLib; Resistor Type: Thick Film,Power resistor; Height: 0.55mm; Case/Package: 2512; ComponentLink3URL: https://datasheet.ciiva.com/25610/0900766b81096b90-25610033.pdf?src-supplier=RSComponents; Max Power Dissipation: 2W; Length: 6.3mm; Packaging: Tape and Reel; ComponentLink3Description: https://datasheet.ciiva.com/25610/0900766b81096b90-25610033.pdf?src-supplier=RSComponents; Voltage Rating (DC): 250V; Min Operating Temperature: -55°C; REACH SVHC: No SVHC; ComponentLink5URL: https://datasheet.ciiva.com/7657/1610601-7657542.pdf?src-supplier=Element14

## Sheet [9] Discharge_Circuit.SchDoc
size A4
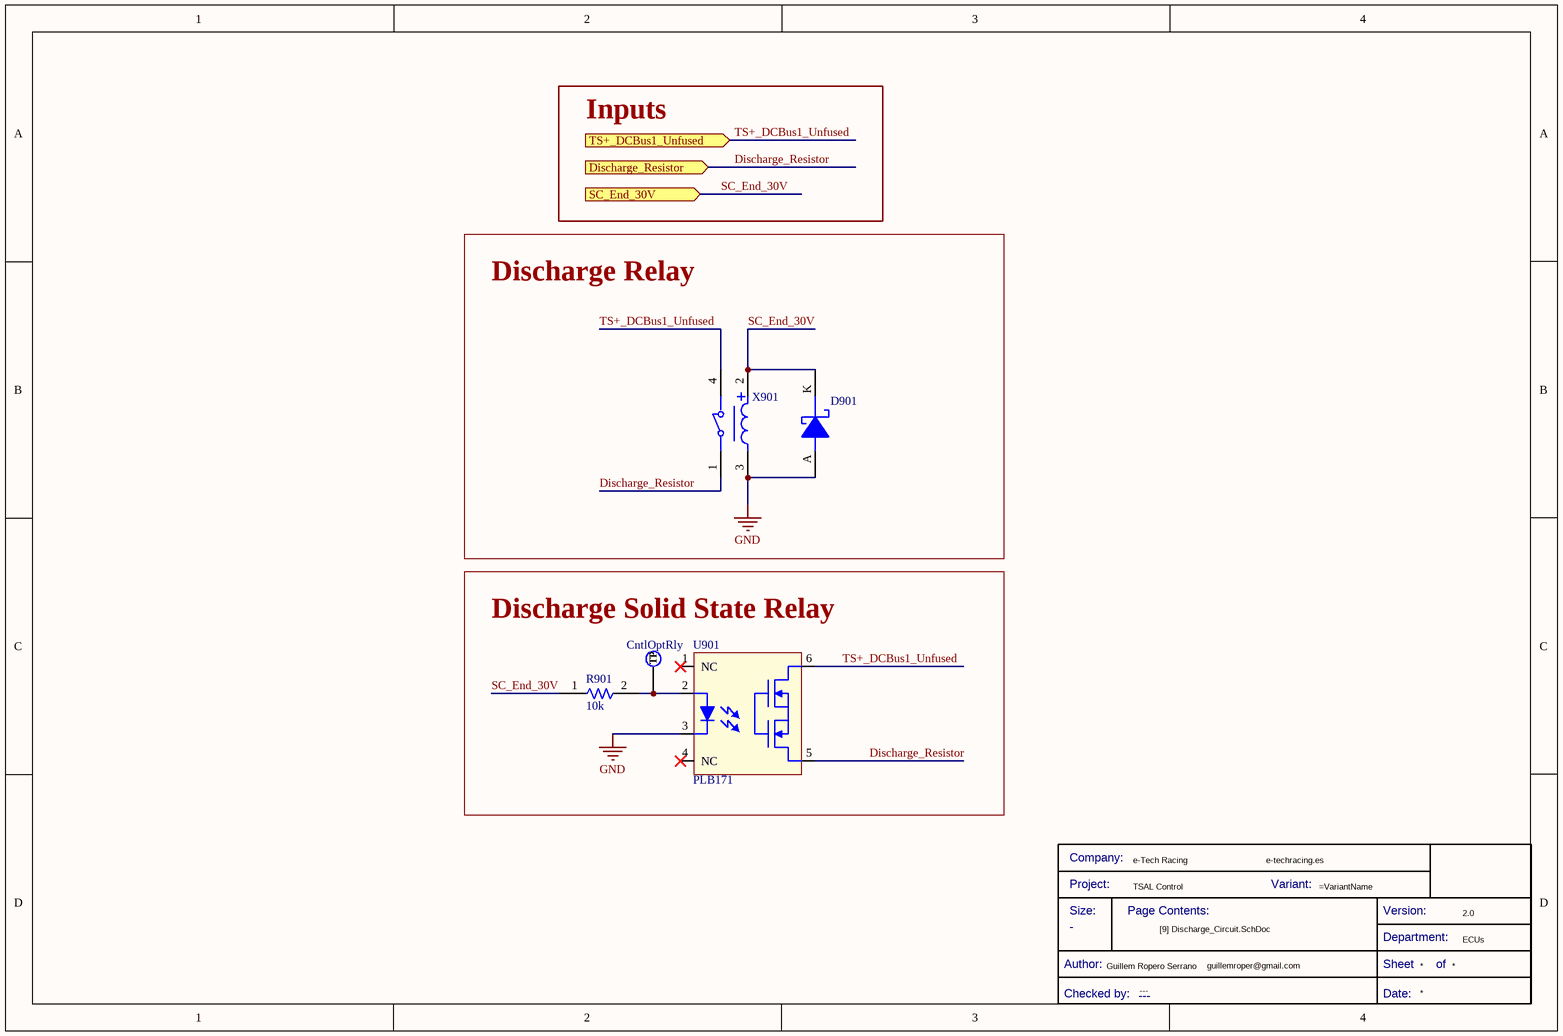
[diagram p9: [9] Discharge_Circuit.SchDoc]

### Parts
(Parts that share a designator on the sheet are numbered #1, #2 ... from top to bottom, then left to right.)
*#10  Checked by:: ---  (hidden comment: Title Block_template)  (graphical)
CntlOptRly  TestPoint  [TestPoint]  (value not drawn)  (no BOM)
D901  DSC-0.5/30-SOD123  [DSC-SOD123]  (value not drawn)
R901  Resistance: 10k  [0805]  (hidden comment: R10k_0805_0.25W)
U901  PLB171  [PLB171]
X901  HV-Relay-SPST-NC-24V  [HV-Relay-SPST-NC-24V]  (value not drawn)

### Blocks framed on the sheet
Discharge Relay: D901 X901
Discharge Solid State Relay: CntlOptRly R901 U901

### Ports
Discharge_Resistor (in, see TSAL_Control[1D]), SC_End_30V (in, see TSAL_Control[1D]), TS+_DCBus1_Unfused (in, see TSAL_Control[1D])

### Nets
GND: D901.A U901.3(CNTRL-) X901.3
Discharge_Resistor: U901.5(Load-) X901.1 ; port Discharge_Resistor
SC_End_30V: D901.K R901.1 X901.2 ; port SC_End_30V
TS+_DCBus1_Unfused: U901.6(Load+) X901.4 ; port TS+_DCBus1_Unfused
NetCntlOptRly_1: CntlOptRly.1(TP) R901.2 U901.2(CNTRL+)

Not connected (* = marked no-connect by the designer): U901 1(NC)* 4(NC)*

### Notes on the sheet
- Inputs
- (in symbol CMP-00043-8) Company:; Project:; Variant:; Size:; Page Contents:; Version:; Department:; Author:; Sheet; of; Checked by:; Date:

### Library data of the parts
*#10 = CMP-00043-8: Standard Title Block; .SCHcheck: GP; Size: -; Design Item ID: Title Block_template; .PCBcheck: GP; .Creator: GP; Source: e-Tech_Racing.SchLib; Category: Title Block
CntlOptRly = CMP-00042-2: Test Point 1x1 mm; .PCBcheck: GP; Source: e-Tech_Racing.SchLib; Design Item ID: TestPoint; .Creator: GP; Category: TestPoint; .SCHcheck: GP
D901 = CMP-00165-2: VR=30V IF=500mA 30pF P=410mW; Peak Non-Repetitive Surge Current: 5.5A; .Creator: GP; Voltage Rating (DC): 30V; Current Rating: 500mA; Max Reverse Leakage Current: 130uA; Element Configuration: Single; Polarity: Standard; Forward Voltage: 430mV; ComponentLink5Description: https://datasheet.ciiva.com/910/mbr0530-910516.pdf?src-supplier=Digi-Key; ComponentLink2Description: Where buy it; ComponentLink1Description: Datasheet; Pricing 1: 1=0,34400, 10=0,23900, 100=0,12200, 500=0,10000 (USD); ComponentLink7Description: https://datasheet.ciiva.com/8300/mbr0530-8300905.pdf?src-supplier=Avnet; ComponentLink3URL: https://datasheet.ciiva.com/30479/0900766b810e2512-30479401.pdf?src-supplier=RSComponents; Stock 1: 9; Max Reverse Voltage (DC): 30V; Max Repetitive Reverse Voltage (Vrrm): 30V; Width: 1.6mm; ComponentLink6URL: https://datasheet.ciiva.com/25931/mbr0530-25931989.pdf?src-supplier=Avnet+Europe; Contact Plating: Tin,Matte; Height: 1.03mm; Category: Diode; ComponentLink1URL: *; Max Surge Current: 5.5A; ComponentLink4URL: https://datasheet.ciiva.com/34301/974753-34301826.pdf?src-supplier=Jameco; ComponentLink4Description: https://datasheet.ciiva.com/34301/974753-34301826.pdf?src-supplier=Jameco; ComponentLink5URL: https://datasheet.ciiva.com/910/mbr0530-910516.pdf?src-supplier=Digi-Key; Length: 2.7mm; ComponentLink10URL: https://datasheet.ciiva.com/910/mbr0530-910518.pdf?src-supplier=Digi-Key; ComponentLink2URL: *; ComponentLink7URL: https://datasheet.ciiva.com/8300/mbr0530-8300905.pdf?src-supplier=Avnet; Max Forward Surge Current (Ifsm): 5.5A; Design Item ID: DSC-0.5/30-SOD123; REACH SVHC: No SVHC; Package Quantity: 1; RoHS Compliant: Yes; Lead Free: Lead Free; Max Reverse Current: 130uA; ComponentLink8Description: https://datasheet.ciiva.com/17318/mbr0530-17318568.pdf?src-supplier=Future+Electronics; Series: -; Average Rectified Current: 500mA; Source: Filter components.SchLib; Output Current: 500mA; ComponentLink9URL: https://datasheet.ciiva.com/15144/getdatasheetpartid-86760-15144598.pdf?src-supplier=Verical; Weight: 0.03g; ComponentLink6Description: https://datasheet.ciiva.com/25931/mbr0530-25931989.pdf?src-supplier=Avnet+Europe; ComponentLink9Description: https://datasheet.ciiva.com/15144/getdatasheetpartid-86760-15144598.pdf?src-supplier=Verical; Mount: Surface Mount; ComponentLink3Description: https://datasheet.ciiva.com/30479/0900766b810e2512-30479401.pdf?src-supplier=RSComponents; Forward Current: 500mA; Radiation Hardening: No; ComponentLink8URL: https://datasheet.ciiva.com/17318/mbr0530-17318568.pdf?src-supplier=Future+Electronics; ComponentLink10Description: https://datasheet.ciiva.com/910/mbr0530-910518.pdf?src-supplier=Digi-Key
R901 = CMP-009-00035-5: Resistor, 10K, 0.25W, Thick Film, 0805 Rohs Compliant: Yes
U901 = CMP-00229-1: Transistor Output SSR; Reach SVHC Compliant: Yes; Optoelectronic Device Type: TRANSISTOR OUTPUT SSR
X901 = CMP-00224-4: Dry Reed Relay, SPST-NC, 3500V switching voltage, 3A, 10kV isolation coil-contacts, 5504-24-1; Terminal Finish: Tin; Relay Type: DRY REED RELAY; RoHS Compliant: Yes; Reach SVHC Compliant: Yes; JESD-609 Code: e3